# Altium schematic sheet AFE_BQ-Chip.SchDoc
size A4
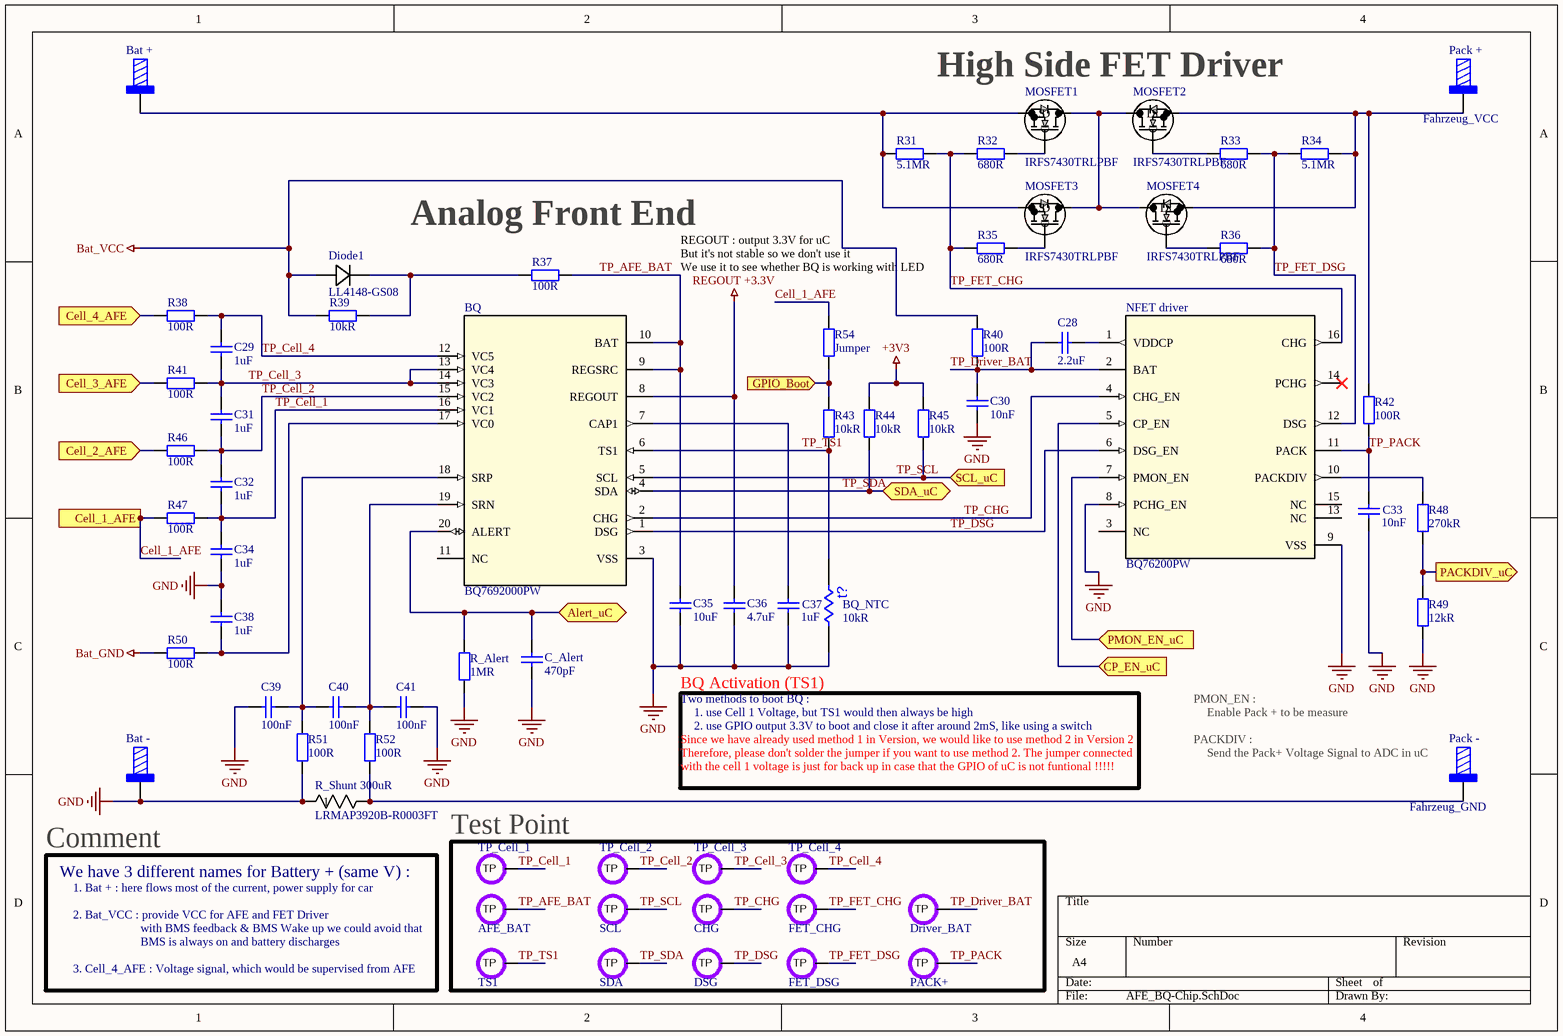
[diagram p0: AFE_BQ-Chip.SchDoc]

## Parts
AFE_BAT  TP_1  [Test point]  (value not drawn)  (no BOM)
Bat_+  M4x6mm  [7461096_for chemical surfaces]  (value not drawn)
Bat_-  M4x6mm  [7461096_for chemical surfaces]  (value not drawn)
BQ  BQ7692000PW  [PW0020A_N]
BQ_NTC  10kR  [J1-0603]
C28  2.2uF  [1608[0603]]
C29  1uF  [1608[0603]]
C30  10nF  [1608[0603]]
C31  1uF  [1608[0603]]
C32  1uF  [1608[0603]]
C33  10nF  [1608[0603]]
C34  1uF  [1608[0603]]
C35  10uF  [1608[0603]]
C36  4.7uF  [1608[0603]]
C37  1uF  [1608[0603]]
C38  1uF  [1608[0603]]
C39  100nF  [1608[0603]]
C40  100nF  [1608[0603]]
C41  100nF  [1608[0603]]
C_Alert  470pF  [1608[0603]]
CHG  TP_1  [Test point]  (value not drawn)  (no BOM)
Diode1  LL4148-GS08  [MELF_SOD-80_VIS]
Driver_BAT  TP_1  [Test point]  (value not drawn)  (no BOM)
DSG  TP_1  [Test point]  (value not drawn)  (no BOM)
FET_CHG  TP_1  [Test point]  (value not drawn)  (no BOM)
FET_DSG  TP_1  [Test point]  (value not drawn)  (no BOM)
MOSFET1  IRFS7430TRLPBF  [D2PAK_TO-263AB_INF-M]
MOSFET2  IRFS7430TRLPBF  [D2PAK_TO-263AB_INF-M]
MOSFET3  IRFS7430TRLPBF  [D2PAK_TO-263AB_INF-M]
MOSFET4  IRFS7430TRLPBF  [D2PAK_TO-263AB_INF-M]
NFET_driver  BQ76200PW  [PW0016A_L]
PACK+  TP_1  [Test point]  (value not drawn)  (no BOM)
Pack_+  Fahrzeug_VCC  [7461096_for chemical surfaces]
Pack_-  Fahrzeug_GND  [7461096_for chemical surfaces]
R31  5.1MR  [J1-0603]
R32  680R  [J1-0603]
R33  680R  [J1-0603]
R34  5.1MR  [J1-0603]
R35  680R  [J1-0603]
R36  680R  [J1-0603]
R37  100R  [J1-0603]
R38  100R  [J1-0603]
R39  10kR  [J1-0603]
R40  100R  [J1-0603]
R41  100R  [J1-0603]
R42  100R  [J1-0603]
R43  10kR  [J1-0603]
R44  10kR  [J1-0603]
R45  10kR  [J1-0603]
R46  100R  [J1-0603]
R47  100R  [J1-0603]
R48  270kR  [J1-0603]
R49  12kR  [J1-0603]
R50  100R  [J1-0603]
R51  100R  [J1-0603]
R52  100R  [J1-0603]
R54  Jumper  [J1-0603]
R_Alert  1MR  [J1-0603]
R_Shunt_300uR  LRMAP3920B-R0003FT  [RES_LRMAP3920B-R0003FT_WEL]
SCL  TP_1  [Test point]  (value not drawn)  (no BOM)
SDA  TP_1  [Test point]  (value not drawn)  (no BOM)
TP_Cell_1  TP_1  [Test point]  (value not drawn)  (no BOM)
TP_Cell_2  TP_1  [Test point]  (value not drawn)  (no BOM)
TP_Cell_3  TP_1  [Test point]  (value not drawn)  (no BOM)
TP_Cell_4  TP_1  [Test point]  (value not drawn)  (no BOM)
TS1  TP_1  [Test point]  (value not drawn)  (no BOM)

## Blocks framed on the sheet
Test Point: AFE_BAT CHG Driver_BAT DSG FET_CHG FET_DSG PACK+ SCL SDA TP_Cell_1-TP_Cell_4 TS1

## Ports
Alert_uC (bidir), Cell_1_AFE (in), Cell_2_AFE (in), Cell_3_AFE (in), Cell_4_AFE (in), CP_EN_uC (in), GPIO_Boot (in), PACKDIV_uC (out), PMON_EN_uC (in), SCL_uC (in), SDA_uC (bidir)

## Nets
+3V3: R44.1 R45.1
Bat_GND: R50.2
Bat_VCC: Diode1.2 R39.2 R40.1
GND: Bat_-.1 BQ.3(VSS) BQ_NTC.2 C30.1 C33.2 C34.1 C35.2 C36.2 C37.2 C38.1 C39.2 C41.1 C_Alert.2 NFET_driver.8(PCHG_EN) NFET_driver.9(VSS) R49.1 R51.2 R_Alert.2 R_Shunt_300uR.1
REGOUT +3.3V: BQ.8(REGOUT) C36.1
Alert_uC: BQ.20(ALERT) C_Alert.1 R_Alert.1 ; port Alert_uC
Cell_1_AFE: R47.2 R54.2 ; port Cell_1_AFE
Cell_2_AFE: R46.2 ; port Cell_2_AFE
Cell_3_AFE: R41.2 ; port Cell_3_AFE
Cell_4_AFE: R38.2 ; port Cell_4_AFE
CP_EN_uC: NFET_driver.5(CP_EN) ; port CP_EN_uC
GPIO_Boot: R43.1 R54.1 ; port GPIO_Boot
PACKDIV_uC: R48.1 R49.2 ; port PACKDIV_uC
PMON_EN_uC: NFET_driver.7(PMON_EN) ; port PMON_EN_uC
TP_AFE_BAT: AFE_BAT.1(TP) BQ.9(REGSRC) BQ.10(BAT) C35.1 R37.1
TP_Cell_1: BQ.16(VC1) C32.1 C34.2 R47.1 TP_Cell_1.1(TP)
TP_Cell_2: BQ.15(VC2) C31.1 C32.2 R46.1 TP_Cell_2.1(TP)
TP_Cell_3: BQ.13(VC4) BQ.14(VC3) C29.1 C31.2 R41.1 TP_Cell_3.1(TP)
TP_Cell_4: BQ.12(VC5) C29.2 R38.1 TP_Cell_4.1(TP)
TP_CHG: BQ.2(CHG) CHG.1(TP) NFET_driver.4(CHG_EN)
TP_Driver_BAT: C28.2 C30.2 Driver_BAT.1(TP) NFET_driver.2(BAT) R40.2
TP_DSG: BQ.1(DSG) DSG.1(TP) NFET_driver.6(DSG_EN)
TP_FET_CHG: FET_CHG.1(TP) NFET_driver.16(CHG) R31.2 R32.1 R35.1
TP_FET_DSG: FET_DSG.1(TP) NFET_driver.12(DSG) R33.2 R34.1 R36.2
TP_PACK: C33.1 NFET_driver.11(PACK) PACK+.1(TP) R42.1
TP_SCL: BQ.5(SCL) R45.2 SCL.1(TP) ; port SCL_uC
TP_SDA: BQ.4(SDA) R44.2 SDA.1(TP) ; port SDA_uC
TP_TS1: BQ.6(TS1) BQ_NTC.1 R43.2 TS1.1(TP)
NetBat_+_1: Bat_+.1 MOSFET1.3(S) MOSFET3.3(S) R31.1
NetBQ_7: BQ.7(CAP1) C37.1
NetBQ_17: BQ.17(VC0) C38.2 R50.1
NetBQ_18: BQ.18(SRP) C39.1 C40.2 R51.1
NetBQ_19: BQ.19(SRN) C40.1 C41.2 R52.1
NetC28_1: C28.1 NFET_driver.1(VDDCP)
NetDiode1_1: Diode1.1 R37.2 R39.1
NetMOSFET1_1: MOSFET1.1(G) R32.2
NetMOSFET1_2: MOSFET1.2(D) MOSFET2.2(D) MOSFET3.2(D) MOSFET4.2(D)
NetMOSFET2_1: MOSFET2.1(G) R33.1
NetMOSFET2_3: MOSFET2.3(S) MOSFET4.3(S) Pack_+.1 R34.2 R42.2
NetMOSFET3_1: MOSFET3.1(G) R35.2
NetMOSFET4_1: MOSFET4.1(G) R36.1
NetNFET_driver_10: NFET_driver.10(PACKDIV) R48.2
NetPack_-_1: Pack_-.1 R52.2 R_Shunt_300uR.2

Not connected (* = marked no-connect by the designer): BQ 11(NC); NFET_driver 3(NC) 13(NC) 14(PCHG)* 15(NC)

## Notes on the sheet
- High Side FET Driver
- (near R37) Analog Front End
- REGOUT : output 3.3V for uC
- But it's not stable so we don't use it
- (near R35) We use it to see whether BQ is working with LED
- BQ Activation (TS1)
- Two methods to boot BQ :
- 1. use Cell 1 Voltage, but TS1 would then always be high
- PMON_EN :
- Enable Pack + to be measure
- Since we have already used method 1 in Version, we would like to use method 2 in Version 2
- Therefore, please don't solder the jumper if you want to use method 2. The jumper connected
- with the cell 1 voltage is just for back up in case that the GPIO of uC is not funtional !!!!!
- 2. use GPIO output 3.3V to boot and close it after around 2mS, like using a switch
- PACKDIV :
- (near Pack_-) Send the Pack+ Voltage Signal to ADC in uC
- (near Bat_-) Comment
- We have 3 different names for Battery + (same V) :
- 1. Bat + : here flows most of the current, power supply for car
- 2. Bat_VCC : provide VCC for AFE and FET Driver
- (near TS1) 3. Cell_4_AFE : Voltage signal, which would be supervised from AFE
- with BMS feedback & BMS Wake up we could avoid that
- BMS is always on and battery discharges
- (in symbol Res Thermal) t?

## Library data of the parts
AFE_BAT CHG Driver_BAT DSG FET_CHG FET_DSG PACK+ SCL SDA TP_Cell_1-TP_Cell_4 TS1 = Test point
Bat_+ Bat_- Pack_+ Pack_- = 7461096: WP-SHFU Press-Fit with External thread, full plain, 7x7mm, 9 pins, M4x6mm, 130A; Pin Number: 9; Thread Length: 6mm; Thread: M4; Surface: Tin; ComponentLink1Description: Manufacturer; ComponentLink1URL: http://www.we-online.de; ComponentLink2Description: Datasheet; ComponentLink2URL: https://katalog.we-online.com/em/datasheet/7461096.pdf; Operating Temperature: -55 to +150degC; Height: 9mm; Material: Brass; Part Number: 7461096; Packaging: Bulk; Mounting Technology: Press-Fit; Rated Current: 130A; Publisher: Wurth Elektronik; Published Date: September 2019; Size: 7x7mm
BQ = BQ7692000PW: AFE Cell battery monitor; PartNumber: BQ7692000PWR; Manufacturer: Texas Instruments; RefDes: RefDes; Type: DEV; Value: Value; Copyright: Copyright (C) 2018 Accelerated Designs. All rights reserved
BQ_NTC = Res Thermal: Thermistor; Published: 24-Mar-1999; LatestRevisionDate: 29-May-2009; LatestRevisionNote: IPC-7351 Footprint Added.; PackageVersion: Mar-2003; PackageReference: 6-0805; Publisher: Altium Limited; PackageDescription: Chip Resistor 0805 Case Size; Code_IPC: RESC2012
C28-C41 C_Alert = Cap: Capacitor; Value: 220nF; Published: 8-Jun-2000; LatestRevisionDate: 17-Jul-2002; LatestRevisionNote: Re-released for DXP Platform.; PackageReference: RAD-0.3; Publisher: Altium Limited; PackageDescription: Radial Cap, Thru-Hole; 2 Leads; 0.3 in Pin Spacing
Diode1 = LL4148-GS08: No Description Available; Vendor: Vishay; Built_By: EMA_UL_Team; SourceLibrary: Vishay_2020-02-10; Manufacturer_Part_Number: LL4148-GS08; Copyright: Copyright (C) 2018 Accelerated Designs. All rights reserved; RefDes: RefDes; Type: DEV
MOSFET1-MOSFET4 = IRFS7430TRLPBF: No Description Available; Vendor: Infineon; Built_By: EMA_Cory; SourceLibrary: Infineon_2020-06-10; Datasheet: https://www.infineon.com/dgdl/Infineon-IRFS7430-DS-v01_00-EN.pdf?fileId=5546d462576f3475015792dbfbd6000d; Manufacturer_Part_Number: IRFS7430TRLPBF; Copyright: Copyright (C) 2018 Accelerated Designs. All rights reserved; RefDes: RefDes; Type: DEV
NFET_driver = BQ76200PW: high-side NFET driver; PartNumber: BQ76200PWR; Manufacturer: Texas Instruments; CompType: IC; PIN_COUNT: 16; Application_BuildNumber: *; Alternate_PartNumber: BQ76200PW; PackageReference: PW0016A; MountType: SMT; RoHS: Y; RefDes: RefDes; Type: DEV; Value: Value; Copyright: Copyright (C) 2018 Accelerated Designs. All rights reserved
R31-R38 R40-R42 R46-R52 R54 R_Alert = Res2: Resistor; Value: 10kR; Published: 8-Jun-2000; LatestRevisionDate: 17-Jul-2002; LatestRevisionNote: Re-released for DXP Platform.; PackageReference: AXIAL-0.4; Publisher: Altium Limited; PackageDescription: Axial Device, Thru-Hole; 2 Leads; 0.4 in Pin Spacing
R39 R43-R45 = Res2: Resistor; Published: 8-Jun-2000; LatestRevisionDate: 17-Jul-2002; LatestRevisionNote: Re-released for DXP Platform.; PackageReference: AXIAL-0.4; Publisher: Altium Limited; PackageDescription: Axial Device, Thru-Hole; 2 Leads; 0.4 in Pin Spacing; Value: 10kR
R_Shunt_300uR = LRMAP3920B-R0003FT: No Description Available; Vendor: Welwyn; Built_By: EMA_Anthony; SourceLibrary: Welwyn_2019-11-05; Copyright: Copyright (C) 2018 Accelerated Designs. All rights reserved; Manufacturer_Part_Number: LRMAP3920B-R0003FT; RefDes: RefDes; Type: DEV